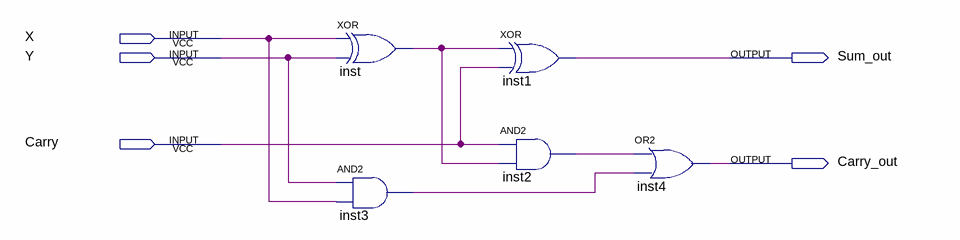
[diagram p0: schematic sheet]
// Quartus schematic fulladder1bit.bdf as structural Verilog: 5 symbols, 5 pins
module fulladder1bit (
  input  X,
  input  Y,
  input  Carry,
  output Sum_out,
  output Carry_out
);

  wire inst2_out, inst3_out, inst_out;

  xor inst (inst_out, X, Y);
  and inst3 (inst3_out, Y, X);
  xor inst1 (Sum_out, inst_out, Carry);
  and inst2 (inst2_out, Carry, inst_out);
  or inst4 (Carry_out, inst2_out, inst3_out);
endmodule
